# EAGLE design KombyPi (EAGLE 7.2.0)
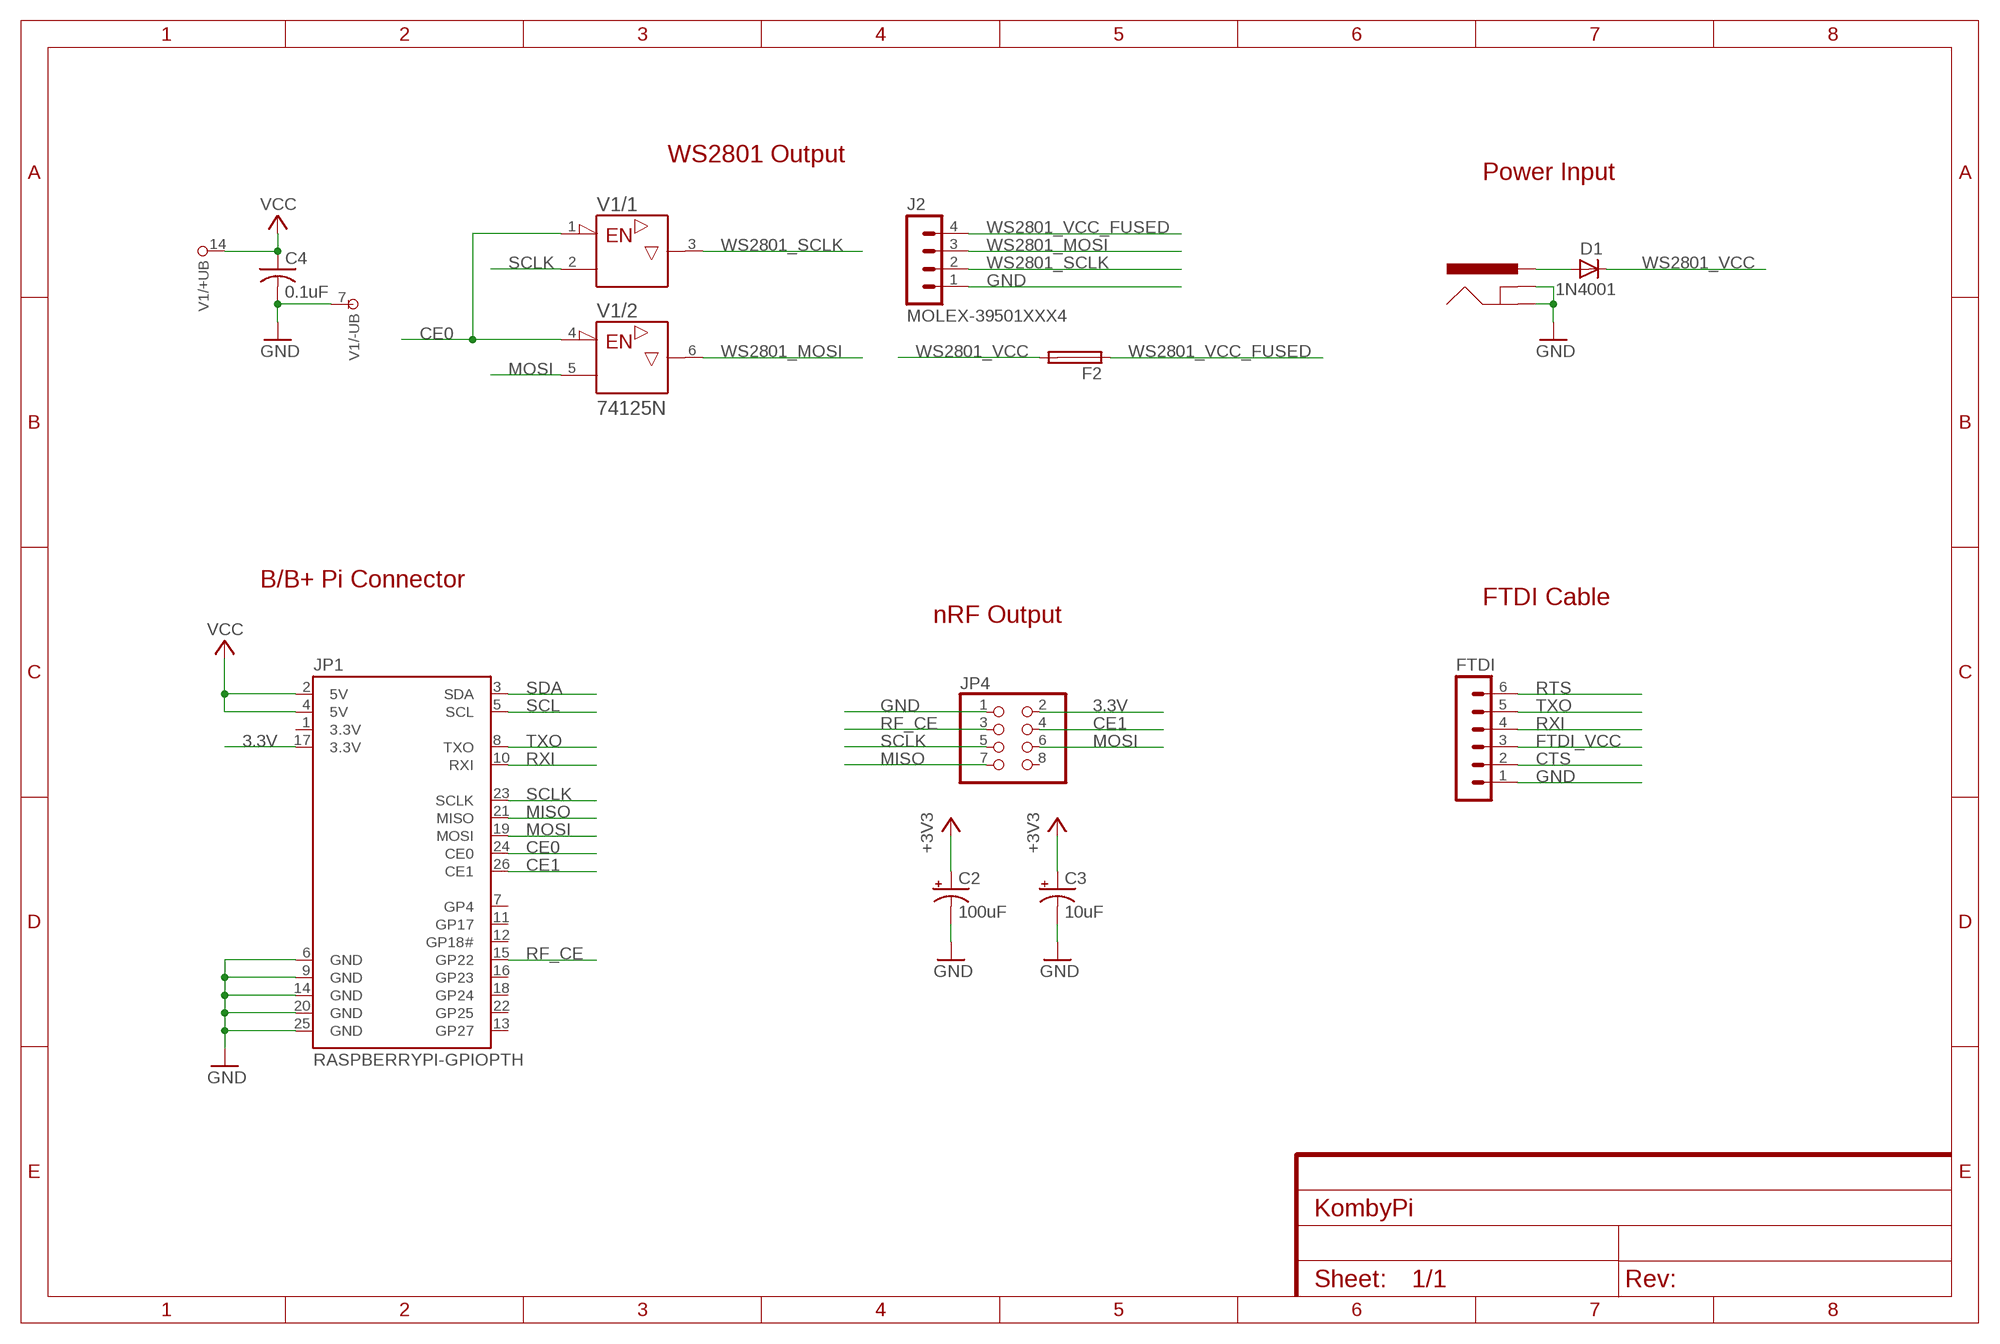
[diagram p0: schematic, sheet 1]

## Parts
C2  100uF  CAP_POLPTH1  [CPOL-RADIAL-100UF-25V]
C3  10uF  CAP_POLPTH2  [CPOL-RADIAL-10UF-25V]
C4  0.1uF  C-US025-025X050  [C025-025X050]
D1  1N4001  DIODEPTH  [DIODE-0.4]
F2  FUSE_MCCQ_122  [MCCQ_122]
FTDI  MA06-1  [MA06-1]
J1  POWER_JACKPTH  [POWER_JACK_PTH]
J2  MOLEX-39501XXX4  [39501XXX4]
JP1  RASPBERRYPI-GPIOPTH  [2X13-SHROUDED]
JP4  PINHD-2X4  [2X04]
V1  74125N  [DIL14]

## Nets
3.3V [RFBoard]: C2.1(+) C3.1(+) JP1.17(3.3V) JP4.2 ; supply symbol labelled +3V3
CE0: JP1.24(CE0) V1.1(/1:!G) V1.4(/2:!G)
CE1 [RFBoard]: JP1.26(CE1) JP4.4
CTS: FTDI.2
FTDI_VCC: FTDI.3
GND: C2.2(-) C3.2(-) C4.2 FTDI.1 J1.GND J1.GNDBREAK J2.1 JP1.6(GND) JP1.9(GND) JP1.14(GND) JP1.20(GND) JP1.25(GND) JP4.1 V1.7(/-UB:-UB)
MISO [RFBoard]: JP1.21(MISO) JP4.7
MOSI [RFBoard]: JP1.19(MOSI) JP4.6 V1.5(/2:A)
N$3: D1.A J1.PWR
RF_CE [RFBoard]: JP1.15(GP22) JP4.3
RTS: FTDI.6
RXI: FTDI.4 JP1.10(RXI)
SCL: JP1.5(SCL)
SCLK: JP1.23(SCLK) JP4.5 V1.2(/1:A)
SDA: JP1.3(SDA)
TXO: FTDI.5 JP1.8(TXO)
VCC: C4.1 JP1.2(5V) JP1.4(5V) V1.14(/+UB:+UB)
WS2801_MOSI: J2.3 V1.6(/2:Y)
WS2801_SCLK: J2.2 V1.3(/1:Y)
WS2801_VCC: D1.C F2.P$3 F2.P$4
WS2801_VCC_FUSED: F2.P$1 F2.P$2 J2.4
Unconnected: JP1.7(GP4) JP1.11(GP17) JP1.12(GP18#) JP1.13(GP27) JP1.16(GP23) JP1.18(GP24) JP1.22(GP25) JP4.8 V1.8(/3:Y) V1.9(/3:A) V1.10(/3:!G) V1.11(/4:Y) V1.12(/4:A) V1.13(/4:!G)

## Notes on the sheet
- WS2801 Output
- Power Input
- B/B+ Pi Connector
- FTDI Cable
- nRF Output

## Power pins joined to a net without a drawn wire
3.3V: JP1.1(3.3V)

## Library data of the parts
C2 C3 = SparkFun:CAP_POL: Capacitor Polarized These are standard SMD and PTH capacitors. Normally 10uF, 47uF, and 100uF in electrolytic and tantalum varieties. Always verify the external diameter of the through hole cap, it varies with capacity, voltage, and manufacturer. The EIA devices should be standard.
C4 = adafruit:C-US: CAPACITOR, American symbol
D1 = SparkFun:DIODE: Diode These are standard reverse protection diodes and small signal diodes. SMA package can handle up to about 1A. SOD-323 can handle about 200mA. What the SOD-323 package when ordering, there are some mfgs out there that are 5-pin packages.
F2 = fuse_rg:FUSE
FTDI = con-lstb:MA06-1: PIN HEADER; OC_FARNELL: unknown; OC_NEWARK: unknown
J1 = SparkFun:POWER_JACK: Power Jack This is the standard 5.5mm barrel jack for power. The PTH is the most common, proven, reliable, footprint. All others are experimental. The Slot footprint only works if the mill layer is transmitted to the PCB fab house so be warned. Spark Fun Electronics SKU : PRT-00119. Mating wall wart : TOL-00298 (and others)
J2 = molex-3950x:MOLEX-39501XXX4
JP1 = SparkFun-Boards:RASPBERRYPI-GPIO: RASPBERRY PI I/O HEADER As defined for the Revistion 2 Pi.; DIST: sparkfun; DIST_ID: PRT-11490
JP4 = adafruit:PINHD-2X4: PIN HEADER
V1 = 74ttl-din:74*125: Quad bus BUFFER, 3-state

## Net classes
1 RFBoard: width 0.406 mm

## Board
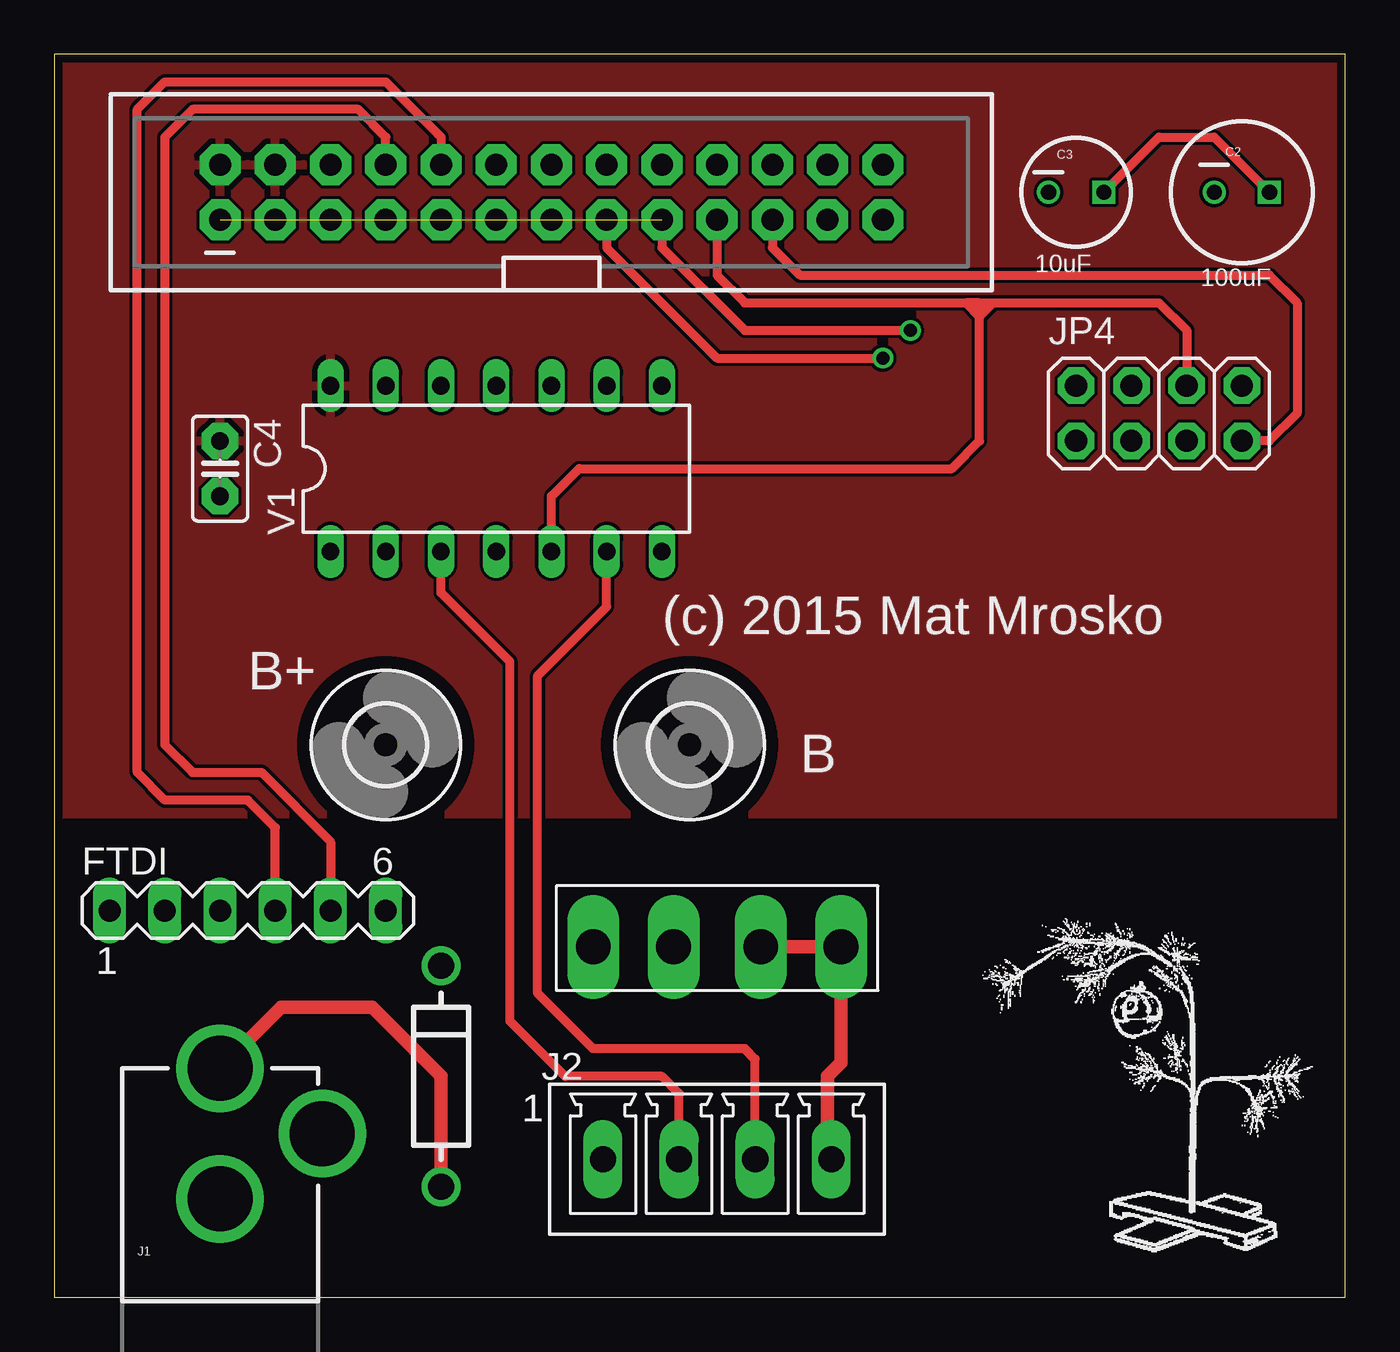
[diagram p1: board, top side]
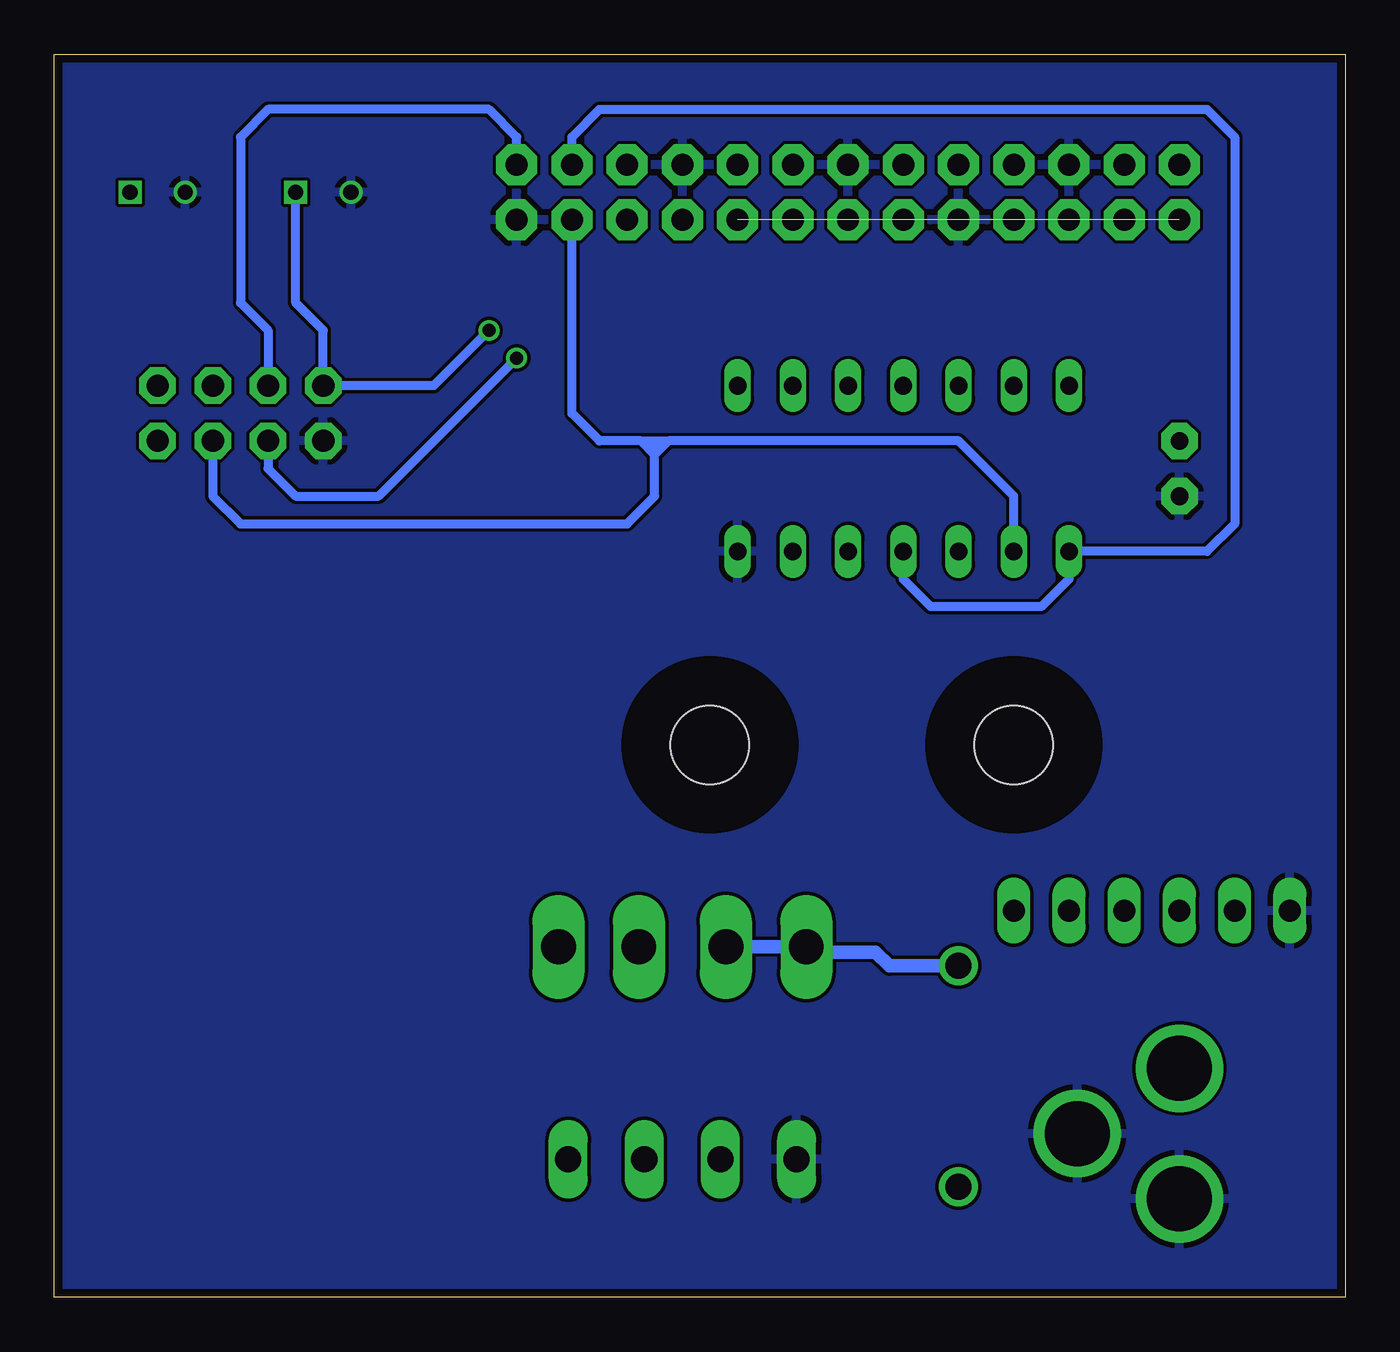
[diagram p2: board, bottom side, seen from below]

Size 59.36 x 57.14 mm. Coordinates in mm from the lower left corner, seen from the top.
Outline: 0,0 59.36,0 59.36,57.14 0,57.14 0,0
Copper layers (1*16): Top 0.0356mm / dielectric 1.5011mm / Bottom 0.0356mm
Design rules "oshpark": minimum track width 6mil, minimum drill 13mil, track to track 6mil, track to pad 6mil, pad to pad 6mil, via to via 6mil, smd to smd 6mil, copper to edge 15mil, drill to drill 6mil, minimum pad ring 7mil, minimum via ring 7mil, stop-mask expansion 4mil, vias tented up to drill 0mil, thermal gap 10mil

### Footprints (pad centres in the part's own frame; a part is rotated, then mirrored left to right if it is on the bottom)
CPOL-RADIAL-100UF-25V = drill 0.7 square: 1 1.27,0 | drill 0.7: 2 -1.27,0
CPOL-RADIAL-10UF-25V = drill 0.7 square: 1 1.27,0 | drill 0.7: 2 -1.27,0
C025-025X050 = drill 0.813 pad 1.676 octagon: 1 -1.27,0; 2 1.27,0
DIODE-0.4 = drill 1.2: A 0,0; C 10.16,0
MCCQ_122 = drill 1.6 pad 2.184 long: P$1 -5.7,0.4; P$2 -2,0.4; P$3 2,0.4; P$4 5.7,0.4
MA06-1 = drill 1.016 long: 1 -6.35,0; 2 -3.81,0; 3 -1.27,0; 4 1.27,0; 5 3.81,0; 6 6.35,0
POWER_JACK_PTH = drill 2.997: GND 0,7.7; GNDBREAK 4.7,10.7; PWR 0,13.7
39501XXX4 = drill 1.2 long: 1 -5.25,0; 2 -1.75,0; 3 1.75,0; 4 5.25,0
2X13-SHROUDED = drill 1.016 pad 1.88 octagon: 1 -1.27,15.24; 2 1.27,15.24; 3 -1.27,12.7; 4 1.27,12.7; 5 -1.27,10.16; 6 1.27,10.16; 7 -1.27,7.62; 8 1.27,7.62; 9 -1.27,5.08; 10 1.27,5.08; 11 -1.27,2.54; 12 1.27,2.54; 13 -1.27,0; 14 1.27,0; 15 -1.27,-2.54; 16 1.27,-2.54; 17 -1.27,-5.08; 18 1.27,-5.08; 19 -1.27,-7.62; 20 1.27,-7.62; 21 -1.27,-10.16; 22 1.27,-10.16; 23 -1.27,-12.7; 24 1.27,-12.7; 25 -1.27,-15.24; 26 1.27,-15.24
2X04 = drill 1.016 pad 1.676 octagon: 1 -3.81,-1.27; 2 -3.81,1.27; 3 -1.27,-1.27; 4 -1.27,1.27; 5 1.27,-1.27; 6 1.27,1.27; 7 3.81,-1.27; 8 3.81,1.27
3,6 = hole 3.6: 0,0
DIL14 = drill 0.813 long: 1 -7.62,-3.81; 2 -5.08,-3.81; 3 -2.54,-3.81; 4 0,-3.81; 5 2.54,-3.81; 6 5.08,-3.81; 7 7.62,-3.81; 8 7.62,3.81; 9 5.08,3.81; 10 2.54,3.81; 11 0,3.81; 12 -2.54,3.81; 13 -5.08,3.81; 14 -7.62,3.81

### Placement (x,y rotation side)
C2  54.61,50.8 0 top
C3  46.99,50.8 0 top
C4  7.62,38.1 270 top
D1  17.78,5.08 90 top
F2  30.48,16.51 180 top
FTDI  8.89,17.78 0 top
J1  7.62,-3.17 0 top
J2  30.48,6.35 0 top
JP1  22.86,50.8 90 top
JP4  50.8,40.64 0 top
U$1  [3,6]  29.21,25.4 0 top
U$2  [3,6]  15.24,25.4 0 top
U$3  [DIYC]  41.91,1.27 0 top
V1  20.32,38.1 0 top

### Tracks (layer width: path | path; a pad name or v marks a point on that pad's centre or on a via)
3.3V  (via drill 0.6)  (1 unrouted)
  Top 0.406: C3.1 50.8,53.34 53.34,53.34 C2.1 | JP1.17 27.94,48.26 31.75,44.45 v39.37,44.45
  Bottom 0.406: C3.1 48.26,45.72 46.99,44.45 JP4.2 41.91,41.91 v39.37,44.45
CE0
  Bottom 0.406: V1.4 20.32,33.02 19.05,31.75 13.97,31.75 12.7,33.02 V1.1 6.35,34.29 5.08,35.56 5.08,53.34 6.35,54.61 34.29,54.61 35.56,53.34 JP1.24
CE1
  Bottom 0.406: JP1.26 38.1,53.34 39.37,54.61 49.53,54.61 50.8,53.34 50.8,45.72 49.53,44.45 JP4.4
GND
  pour Bottom: 0,57.15 0,0 59.69,0 59.69,57.15
MISO
  Top 0.406: JP1.21 33.02,48.26 34.29,46.99 55.88,46.99 57.15,45.72 57.15,40.64 55.88,39.37 JP4.7
MOSI
  Top 0.406: JP1.19 30.48,46.99 31.75,45.72 41.91,45.72 | 42.55,45.72 43.18,45.72 | 42.55,45.72 41.91,45.72 | 41.91,45.72 42.55,45.09 43.18,45.72 | 43.18,45.72 50.8,45.72 52.07,44.45 JP4.6 | V1.5 22.86,36.83 24.13,38.1 41.27,38.1 42.55,39.37 42.55,45.72
N$3
  Top 0.61: D1.A 17.78,10.16 14.61,13.34 10.43,13.34 J1.PWR
RF_CE  (via drill 0.6)
  Top 0.406: JP1.15 25.4,48.26 30.48,43.18 v38.1,43.18
  Bottom 0.406: JP4.3 49.53,38.1 48.26,36.83 44.45,36.83 v38.1,43.18
RXI
  Top 0.406: FTDI.4 10.16,21.59 8.89,22.86 5.08,22.86 3.81,24.13 3.81,54.61 5.08,55.88 15.24,55.88 17.78,53.34 JP1.10
SCLK
  Bottom 0.406: V1.2 15.24,36.83 17.78,39.37 31.11,39.37 | 32.38,39.37 31.11,39.37 | 31.11,39.37 31.75,38.73 | 32.38,39.37 34.29,39.37 35.56,40.64 JP1.23 | JP4.5 52.07,36.83 50.8,35.56 33.02,35.56 31.75,36.83 31.75,38.73 | 31.75,39.37 31.75,38.73 | 31.75,38.73 32.38,39.37
TXO
  Top 0.406: JP1.8 15.24,53.34 13.97,54.61 6.35,54.61 5.08,53.34 5.08,25.4 6.35,24.13 9.53,24.13 12.7,20.95 FTDI.5
VCC
  pour Top: 0,57.15 0,22.23 59.69,22.23 59.69,57.15
WS2801_MOSI
  Top 0.406: J2.3 32.23,10.95 31.75,11.43 24.77,11.43 22.23,13.97 22.23,28.57 25.4,31.75 V1.6
WS2801_SCLK
  Top 0.406: J2.2 28.73,9.37 27.94,10.16 23.5,10.16 20.95,12.7 20.95,29.21 17.78,32.38 V1.3
WS2801_VCC
  Bottom 0.61: F2.P$3 F2.P$4 24.55,15.88 21.59,15.88 20.95,15.24 D1.C
WS2801_VCC_FUSED
  Top 0.61: J2.4 35.56,6.52 35.56,10.16 36.18,10.78 F2.P$1 F2.P$2

### Text on the board
tNames: (c) 2015 Mat Mrosko | B+ | B